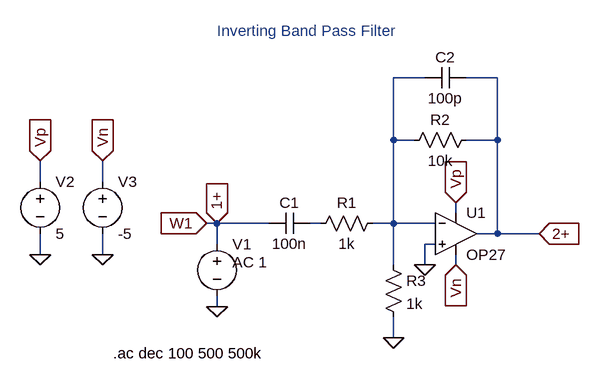
[diagram p0: schematic inv_abpf_gain.asc]
inv_abpf_gain.asc, the LTspice schematic file:
Version 4
SHEET 1 880 680
WIRE 400 -48 352 -48
WIRE 512 -48 464 -48
WIRE 352 48 352 -48
WIRE 384 48 352 48
WIRE 512 48 512 -48
WIRE 512 48 464 48
WIRE -192 112 -192 80
WIRE -96 112 -96 80
WIRE 448 160 448 144
WIRE 80 176 64 176
WIRE 160 176 80 176
WIRE 240 176 224 176
WIRE 352 176 352 48
WIRE 352 176 320 176
WIRE 416 176 352 176
WIRE 512 192 512 48
WIRE 512 192 480 192
WIRE 576 192 512 192
WIRE 80 208 80 176
WIRE 416 208 400 208
WIRE -192 224 -192 192
WIRE -96 224 -96 192
WIRE 352 240 352 176
WIRE 400 240 400 208
WIRE 448 240 448 224
WIRE 80 304 80 288
WIRE 352 352 352 320
FLAG 352 352 0
FLAG 80 304 0
FLAG -192 224 0
FLAG -96 224 0
FLAG -192 80 Vp
IOPIN -192 80 In
FLAG -96 80 Vn
IOPIN -96 80 In
FLAG 448 144 Vp
IOPIN 448 144 In
FLAG 448 240 Vn
IOPIN 448 240 In
FLAG 576 192 2+
IOPIN 576 192 In
FLAG 64 176 W1
IOPIN 64 176 In
FLAG 80 176 1+
IOPIN 80 176 In
FLAG 400 240 0
SYMBOL Opamps\\OP27 448 128 R0
SYMATTR InstName U1
SYMBOL cap 224 160 R90
WINDOW 0 0 32 VBottom 2
WINDOW 3 32 32 VTop 2
SYMATTR InstName C1
SYMATTR Value 100n
SYMBOL res 336 160 R90
WINDOW 0 0 56 VBottom 2
WINDOW 3 32 56 VTop 2
SYMATTR InstName R1
SYMATTR Value 1k
SYMBOL res 480 32 R90
WINDOW 0 0 56 VBottom 2
WINDOW 3 32 56 VTop 2
SYMATTR InstName R2
SYMATTR Value 10k
SYMBOL res 336 224 R0
SYMATTR InstName R3
SYMATTR Value 1k
SYMBOL voltage 80 192 R0
WINDOW 123 24 44 Left 2
WINDOW 39 0 0 Left 0
SYMATTR Value2 AC 1
SYMATTR InstName V1
SYMATTR Value ""
SYMBOL voltage -192 96 R0
WINDOW 123 0 0 Left 0
WINDOW 39 0 0 Left 0
SYMATTR InstName V2
SYMATTR Value 5
SYMBOL voltage -96 96 R0
WINDOW 123 0 0 Left 0
WINDOW 39 0 0 Left 0
SYMATTR InstName V3
SYMATTR Value -5
SYMBOL cap 464 -64 R90
WINDOW 0 0 32 VBottom 2
WINDOW 3 32 32 VTop 2
SYMATTR InstName C2
SYMATTR Value 100p
TEXT -80 376 Left 2 !.ac dec 100 500 500k
TEXT 80 -120 Left 2 ;Inverting Band Pass Filter

The netlist it stands for:
* inv_abpf_gain.asc
XU1 0 N001 Vp Vn 2+ OP27  ; pins In+ In- V+ V- OUT
C1 N002 1+ 100n
R1 N001 N002 1k
R2 2+ N001 10k
R3 N001 0 1k
V1 1+ 0 AC 1
V2 Vp 0 5
V3 Vn 0 -5
C2 2+ N001 100p
.ac dec 100 500 500k
* Inverting Band Pass Filter
.lib ADI.lib
.backanno
.end